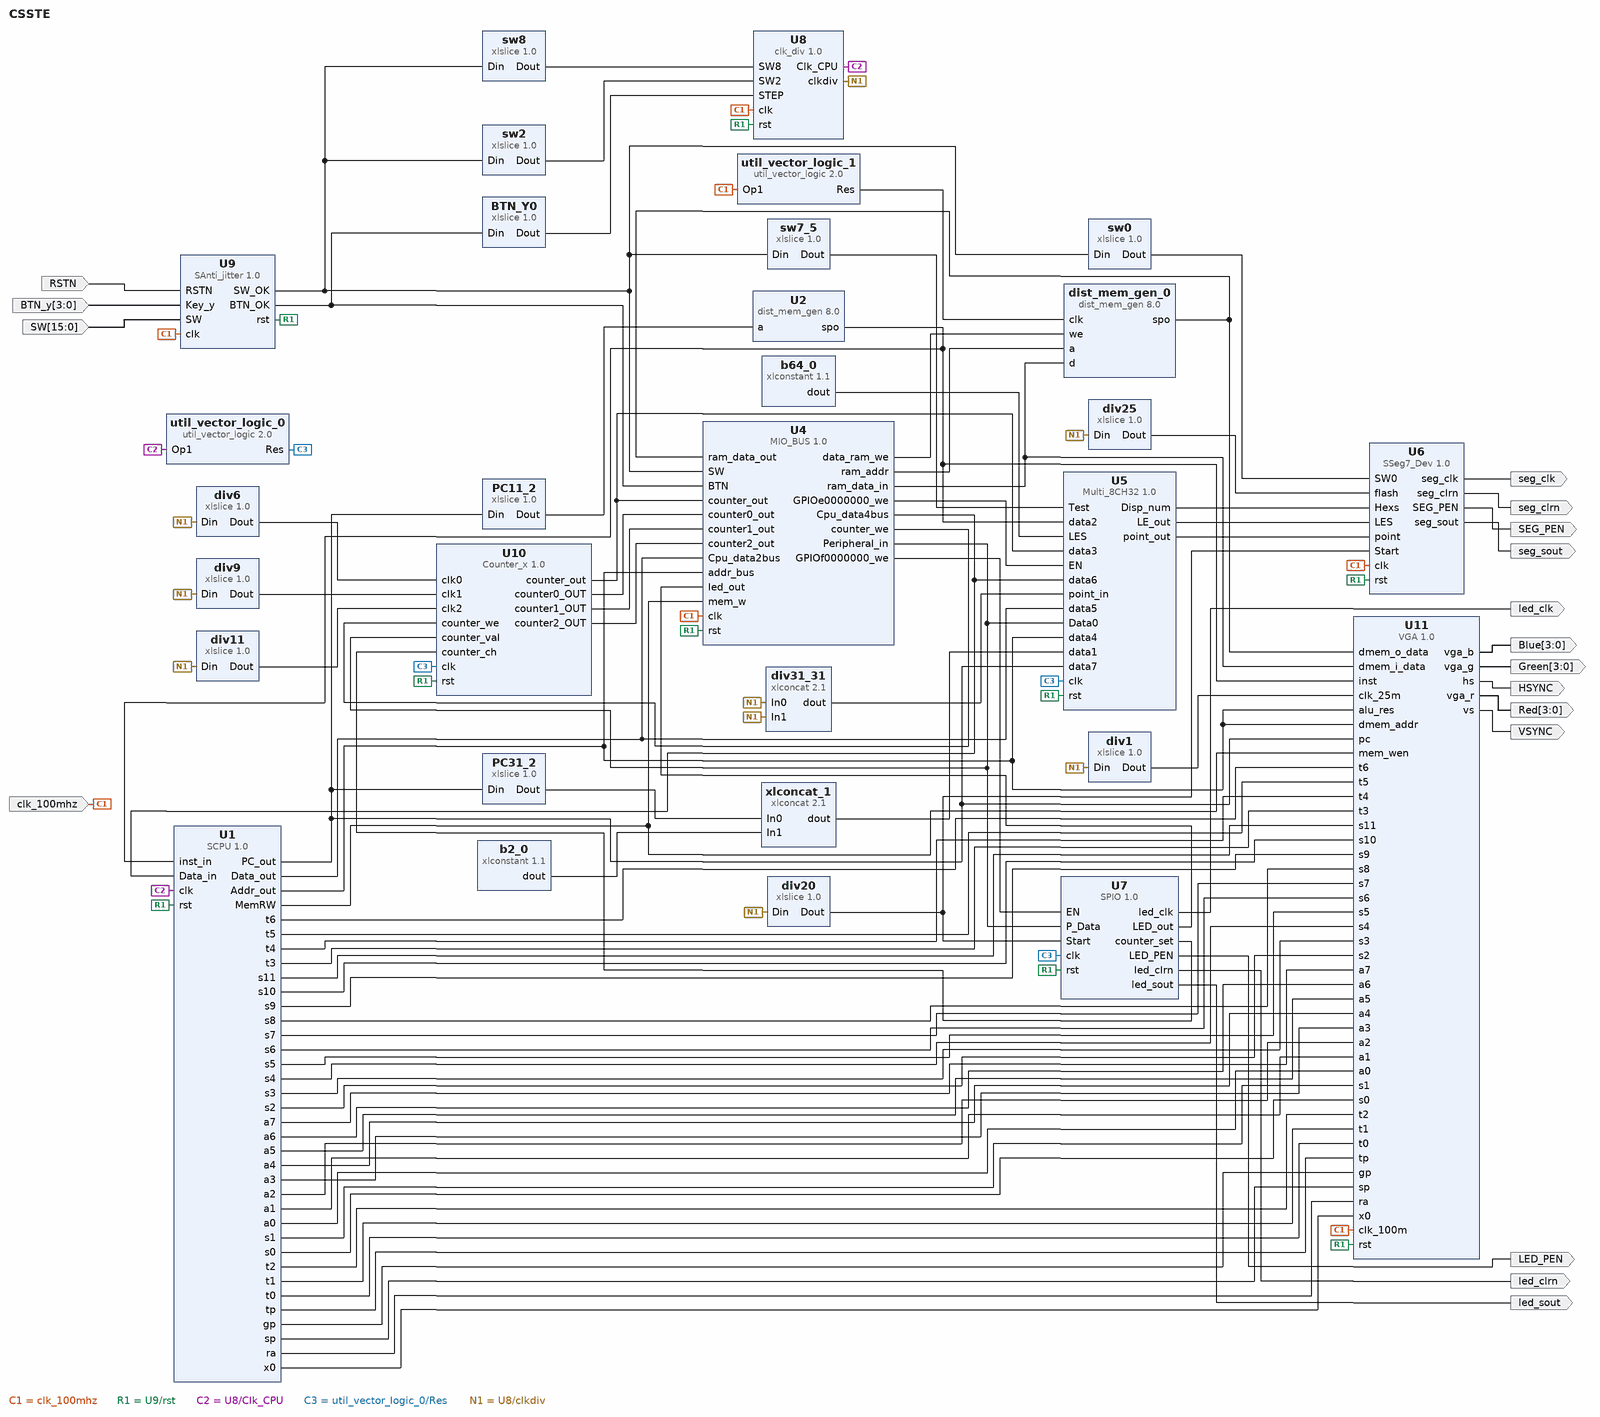
[diagram p0: block diagram of the top level]
# Vivado block design CSSTE, xc7k160tffg676-2L, Vivado 2020.2
create_bd_design CSSTE

create_bd_port -dir I -type rst RSTN
set_property -dict {CONFIG.POLARITY ACTIVE_HIGH} [get_bd_ports RSTN]
create_bd_port -dir I -type clk clk_100mhz
set_property -dict {CONFIG.FREQ_HZ 100000000} [get_bd_ports clk_100mhz]
create_bd_port -dir I -from 3 -to 0 BTN_y
create_bd_port -dir I -from 15 -to 0 SW
create_bd_port -dir O SEG_PEN
create_bd_port -dir O -type clk seg_clk
create_bd_port -dir O seg_clrn
create_bd_port -dir O seg_sout
create_bd_port -dir O LED_PEN
create_bd_port -dir O -type clk led_clk
create_bd_port -dir O led_clrn
create_bd_port -dir O led_sout
create_bd_port -dir O HSYNC
create_bd_port -dir O VSYNC
create_bd_port -dir O -from 3 -to 0 Red
create_bd_port -dir O -from 3 -to 0 Green
create_bd_port -dir O -from 3 -to 0 Blue

create_bd_cell -type ip -vlnv xilinx.com:user:clk_div:1.0 U8
create_bd_cell -type ip -vlnv xilinx.com:user:SSeg7_Dev:1.0 U6
create_bd_cell -type ip -vlnv xilinx.com:user:Counter_x:1.0 U10
create_bd_cell -type ip -vlnv xilinx.com:user:MIO_BUS:1.0 U4
create_bd_cell -type ip -vlnv xilinx.com:user:Multi_8CH32:1.0 U5
create_bd_cell -type ip -vlnv xilinx.com:user:SAnti_jitter:1.0 U9
create_bd_cell -type ip -vlnv xilinx.com:user:SPIO:1.0 U7
create_bd_cell -type ip -vlnv xilinx.com:user:SCPU:1.0 U1
create_bd_cell -type ip -vlnv xilinx.com:user:VGA:1.0 U11
create_bd_cell -type ip -vlnv xilinx.com:ip:dist_mem_gen:8.0 U2
set_property -dict [list \
  CONFIG.coefficient_file ../../../../../../COE/I_mem_more.coe \
  CONFIG.data_width 16 \
  CONFIG.depth 64 \
  CONFIG.memory_type rom \
] [get_bd_cells U2]
create_bd_cell -type ip -vlnv xilinx.com:ip:dist_mem_gen:8.0 dist_mem_gen_0
set_property -dict [list \
  CONFIG.coefficient_file ../../../../../../COE/D_mem.coe \
  CONFIG.data_width 32 \
  CONFIG.depth 1024 \
] [get_bd_cells dist_mem_gen_0]
create_bd_cell -type ip -vlnv xilinx.com:ip:xlslice:1.0 div1
set_property -dict {CONFIG.DIN_FROM 1 CONFIG.DIN_TO 1 CONFIG.DOUT_WIDTH 1} [get_bd_cells div1]
create_bd_cell -type ip -vlnv xilinx.com:ip:xlslice:1.0 div25
set_property -dict {CONFIG.DIN_FROM 25 CONFIG.DIN_TO 25 CONFIG.DOUT_WIDTH 1} [get_bd_cells div25]
create_bd_cell -type ip -vlnv xilinx.com:ip:xlslice:1.0 sw0
set_property -dict {CONFIG.DIN_FROM 0 CONFIG.DIN_TO 0 CONFIG.DIN_WIDTH 16 CONFIG.DOUT_WIDTH 1} [get_bd_cells sw0]
create_bd_cell -type ip -vlnv xilinx.com:ip:xlslice:1.0 BTN_Y0
set_property -dict {CONFIG.DIN_FROM 0 CONFIG.DIN_TO 0 CONFIG.DIN_WIDTH 4 CONFIG.DOUT_WIDTH 1} [get_bd_cells BTN_Y0]
create_bd_cell -type ip -vlnv xilinx.com:ip:util_vector_logic:2.0 util_vector_logic_0
set_property -dict {CONFIG.C_OPERATION not CONFIG.C_SIZE 1} [get_bd_cells util_vector_logic_0]
create_bd_cell -type ip -vlnv xilinx.com:ip:util_vector_logic:2.0 util_vector_logic_1
set_property -dict {CONFIG.C_OPERATION not CONFIG.C_SIZE 1} [get_bd_cells util_vector_logic_1]
create_bd_cell -type ip -vlnv xilinx.com:ip:xlconcat:2.1 div31_31
set_property -dict {CONFIG.IN0_WIDTH 32 CONFIG.IN1_WIDTH 32 CONFIG.dout_width 64} [get_bd_cells div31_31]
create_bd_cell -type ip -vlnv xilinx.com:ip:xlconcat:2.1 xlconcat_1
set_property -dict {CONFIG.dout_width 32} [get_bd_cells xlconcat_1]
create_bd_cell -type ip -vlnv xilinx.com:ip:xlconstant:1.1 b64_0
set_property -dict {CONFIG.CONST_VAL 0 CONFIG.CONST_WIDTH 64} [get_bd_cells b64_0]
create_bd_cell -type ip -vlnv xilinx.com:ip:xlconstant:1.1 b2_0
set_property -dict {CONFIG.CONST_VAL 0 CONFIG.CONST_WIDTH 2} [get_bd_cells b2_0]
create_bd_cell -type ip -vlnv xilinx.com:ip:xlslice:1.0 sw2
set_property -dict {CONFIG.DIN_FROM 2 CONFIG.DIN_TO 2 CONFIG.DIN_WIDTH 16 CONFIG.DOUT_WIDTH 1} [get_bd_cells sw2]
create_bd_cell -type ip -vlnv xilinx.com:ip:xlslice:1.0 sw8
set_property -dict {CONFIG.DIN_FROM 8 CONFIG.DIN_TO 8 CONFIG.DIN_WIDTH 16 CONFIG.DOUT_WIDTH 1} [get_bd_cells sw8]
create_bd_cell -type ip -vlnv xilinx.com:ip:xlslice:1.0 PC11_2
set_property -dict {CONFIG.DIN_FROM 11 CONFIG.DIN_TO 2 CONFIG.DOUT_WIDTH 10} [get_bd_cells PC11_2]
create_bd_cell -type ip -vlnv xilinx.com:ip:xlslice:1.0 div6
set_property -dict {CONFIG.DIN_FROM 6 CONFIG.DIN_TO 6 CONFIG.DOUT_WIDTH 1} [get_bd_cells div6]
create_bd_cell -type ip -vlnv xilinx.com:ip:xlslice:1.0 div9
set_property -dict {CONFIG.DIN_FROM 9 CONFIG.DIN_TO 9 CONFIG.DOUT_WIDTH 1} [get_bd_cells div9]
create_bd_cell -type ip -vlnv xilinx.com:ip:xlslice:1.0 div11
set_property -dict {CONFIG.DIN_FROM 11 CONFIG.DIN_TO 11 CONFIG.DOUT_WIDTH 1} [get_bd_cells div11]
create_bd_cell -type ip -vlnv xilinx.com:ip:xlslice:1.0 sw7_5
set_property -dict {CONFIG.DIN_FROM 7 CONFIG.DIN_TO 5 CONFIG.DIN_WIDTH 16 CONFIG.DOUT_WIDTH 3} [get_bd_cells sw7_5]
create_bd_cell -type ip -vlnv xilinx.com:ip:xlslice:1.0 PC31_2
set_property -dict {CONFIG.DIN_FROM 31 CONFIG.DIN_TO 2 CONFIG.DOUT_WIDTH 30} [get_bd_cells PC31_2]
create_bd_cell -type ip -vlnv xilinx.com:ip:xlslice:1.0 div20
set_property -dict {CONFIG.DIN_FROM 20 CONFIG.DIN_TO 20 CONFIG.DOUT_WIDTH 1} [get_bd_cells div20]

# ---- connections ----

connect_bd_net [get_bd_ports RSTN] [get_bd_pins U9/RSTN]
connect_bd_net [get_bd_ports clk_100mhz] \
  [get_bd_pins U8/clk] [get_bd_pins U6/clk] [get_bd_pins U4/clk] [get_bd_pins U9/clk] [get_bd_pins U11/clk_100m] \
  [get_bd_pins util_vector_logic_1/Op1]
connect_bd_net [get_bd_ports BTN_y] [get_bd_pins U9/Key_y]
connect_bd_net [get_bd_ports SW] [get_bd_pins U9/SW]
connect_bd_net [get_bd_pins U9/BTN_OK] [get_bd_pins U4/BTN] [get_bd_pins BTN_Y0/Din]
connect_bd_net [get_bd_pins U9/SW_OK] [get_bd_pins U4/SW] [get_bd_pins sw0/Din] [get_bd_pins sw2/Din] [get_bd_pins sw8/Din] [get_bd_pins sw7_5/Din]
connect_bd_net [get_bd_pins sw2/Dout] [get_bd_pins U8/SW2]
connect_bd_net [get_bd_pins sw8/Dout] [get_bd_pins U8/SW8]
connect_bd_net [get_bd_pins U9/rst] \
  [get_bd_pins U8/rst] [get_bd_pins U6/rst] [get_bd_pins U10/rst] [get_bd_pins U4/rst] [get_bd_pins U5/rst] \
  [get_bd_pins U7/rst] [get_bd_pins U1/rst] [get_bd_pins U11/rst]
connect_bd_net [get_bd_pins util_vector_logic_1/Res] [get_bd_pins dist_mem_gen_0/clk]
connect_bd_net [get_bd_pins U8/Clk_CPU] [get_bd_pins U1/clk] [get_bd_pins util_vector_logic_0/Op1]
connect_bd_net [get_bd_pins util_vector_logic_0/Res] [get_bd_pins U10/clk] [get_bd_pins U5/clk] [get_bd_pins U7/clk]
connect_bd_net -net SCPU_0_PC_out [get_bd_pins U1/PC_out] \
  [get_bd_pins U5/data7] [get_bd_pins U11/pc] [get_bd_pins PC11_2/Din] [get_bd_pins PC31_2/Din]
connect_bd_net [get_bd_pins PC11_2/Dout] [get_bd_pins U2/a]
connect_bd_net [get_bd_pins U2/spo] [get_bd_pins U5/data2] [get_bd_pins U1/inst_in] [get_bd_pins U11/inst]
connect_bd_net [get_bd_pins U8/clkdiv] \
  [get_bd_pins div1/Din] [get_bd_pins div25/Din] [get_bd_pins div31_31/In0] [get_bd_pins div31_31/In1] [get_bd_pins div6/Din] \
  [get_bd_pins div9/Din] [get_bd_pins div11/Din] [get_bd_pins div20/Din]
connect_bd_net [get_bd_pins div6/Dout] [get_bd_pins U10/clk0]
connect_bd_net [get_bd_pins div9/Dout] [get_bd_pins U10/clk1]
connect_bd_net [get_bd_pins div11/Dout] [get_bd_pins U10/clk2]
connect_bd_net [get_bd_pins U10/counter0_OUT] [get_bd_pins U4/counter0_out]
connect_bd_net [get_bd_pins U10/counter1_OUT] [get_bd_pins U4/counter1_out]
connect_bd_net [get_bd_pins U10/counter2_OUT] [get_bd_pins U4/counter2_out]
connect_bd_net [get_bd_pins U10/counter_out] [get_bd_pins U4/counter_out] [get_bd_pins U5/data3]
connect_bd_net -net SCPU_0_MemRW [get_bd_pins U1/MemRW] [get_bd_pins U4/mem_w] [get_bd_pins U11/mem_wen]
connect_bd_net -net SCPU_0_Data_out [get_bd_pins U1/Data_out] [get_bd_pins U4/Cpu_data2bus] [get_bd_pins U5/data5]
connect_bd_net -net SCPU_0_Addr_out [get_bd_pins U1/Addr_out] \
  [get_bd_pins U4/addr_bus] [get_bd_pins U5/data4] [get_bd_pins U11/alu_res] [get_bd_pins U11/dmem_addr]
connect_bd_net -net U4_Cpu_data4bus [get_bd_pins U4/ram_data_in] [get_bd_pins U11/dmem_i_data] [get_bd_pins dist_mem_gen_0/d]
connect_bd_net [get_bd_pins U4/GPIOe0000000_we] [get_bd_pins U5/EN]
connect_bd_net [get_bd_pins U4/counter_we] [get_bd_pins U10/counter_we]
connect_bd_net [get_bd_pins U4/data_ram_we] [get_bd_pins dist_mem_gen_0/we]
connect_bd_net [get_bd_pins U4/Peripheral_in] [get_bd_pins U10/counter_val] [get_bd_pins U5/Data0] [get_bd_pins U7/P_Data]
connect_bd_net [get_bd_pins U4/ram_addr] [get_bd_pins dist_mem_gen_0/a]
connect_bd_net -net RAM_B_0_douta [get_bd_pins dist_mem_gen_0/spo] [get_bd_pins U4/ram_data_out] [get_bd_pins U11/dmem_o_data]
connect_bd_net -net xlconstant_0_dout [get_bd_pins b64_0/dout] [get_bd_pins U5/LES]
connect_bd_net [get_bd_pins sw7_5/Dout] [get_bd_pins U5/Test]
connect_bd_net [get_bd_pins PC31_2/Dout] [get_bd_pins xlconcat_1/In0]
connect_bd_net [get_bd_pins xlconcat_1/dout] [get_bd_pins U5/data1]
connect_bd_net [get_bd_pins div31_31/dout] [get_bd_pins U5/point_in]
connect_bd_net [get_bd_pins U4/GPIOf0000000_we] [get_bd_pins U7/EN]
connect_bd_net [get_bd_pins div20/Dout] [get_bd_pins U6/Start] [get_bd_pins U7/Start]
connect_bd_net [get_bd_pins U7/LED_out] [get_bd_pins U4/led_out]
connect_bd_net [get_bd_pins U7/counter_set] [get_bd_pins U10/counter_ch]
connect_bd_net [get_bd_pins div1/Dout] [get_bd_pins U11/clk_25m]
connect_bd_net [get_bd_pins sw0/Dout] [get_bd_pins U6/SW0]
connect_bd_net [get_bd_pins div25/Dout] [get_bd_pins U6/flash]
connect_bd_net -net Multi_8CH32_0_Disp_num [get_bd_pins U5/Disp_num] [get_bd_pins U6/Hexs]
connect_bd_net -net Multi_8CH32_0_LE_out [get_bd_pins U5/LE_out] [get_bd_pins U6/LES]
connect_bd_net -net Multi_8CH32_0_point_out [get_bd_pins U5/point_out] [get_bd_pins U6/point]
connect_bd_net [get_bd_pins U6/SEG_PEN] [get_bd_ports SEG_PEN]
connect_bd_net [get_bd_pins U6/seg_clk] [get_bd_ports seg_clk]
connect_bd_net [get_bd_pins U6/seg_clrn] [get_bd_ports seg_clrn]
connect_bd_net [get_bd_pins U6/seg_sout] [get_bd_ports seg_sout]
connect_bd_net [get_bd_pins U7/LED_PEN] [get_bd_ports LED_PEN]
connect_bd_net [get_bd_pins U7/led_clk] [get_bd_ports led_clk]
connect_bd_net [get_bd_pins U7/led_clrn] [get_bd_ports led_clrn]
connect_bd_net [get_bd_pins U7/led_sout] [get_bd_ports led_sout]
connect_bd_net -net VGA_0_hs [get_bd_pins U11/hs] [get_bd_ports HSYNC]
connect_bd_net -net VGA_0_vs [get_bd_pins U11/vs] [get_bd_ports VSYNC]
connect_bd_net -net VGA_0_vga_r [get_bd_pins U11/vga_r] [get_bd_ports Red]
connect_bd_net -net VGA_0_vga_g [get_bd_pins U11/vga_g] [get_bd_ports Green]
connect_bd_net -net VGA_0_vga_b [get_bd_pins U11/vga_b] [get_bd_ports Blue]
connect_bd_net [get_bd_pins U4/Cpu_data4bus] [get_bd_pins U5/data6] [get_bd_pins U1/Data_in]
connect_bd_net [get_bd_pins b2_0/dout] [get_bd_pins xlconcat_1/In1]
connect_bd_net [get_bd_pins U1/t6] [get_bd_pins U11/t6]
connect_bd_net [get_bd_pins U1/t5] [get_bd_pins U11/t5]
connect_bd_net [get_bd_pins U1/t4] [get_bd_pins U11/t4]
connect_bd_net [get_bd_pins U1/t3] [get_bd_pins U11/t3]
connect_bd_net [get_bd_pins U1/s11] [get_bd_pins U11/s11]
connect_bd_net [get_bd_pins U1/s10] [get_bd_pins U11/s10]
connect_bd_net [get_bd_pins U1/s9] [get_bd_pins U11/s9]
connect_bd_net [get_bd_pins U1/s8] [get_bd_pins U11/s8]
connect_bd_net [get_bd_pins U1/s7] [get_bd_pins U11/s7]
connect_bd_net [get_bd_pins U1/s6] [get_bd_pins U11/s6]
connect_bd_net [get_bd_pins U1/s5] [get_bd_pins U11/s5]
connect_bd_net [get_bd_pins U1/s4] [get_bd_pins U11/s4]
connect_bd_net [get_bd_pins U1/s3] [get_bd_pins U11/s3]
connect_bd_net [get_bd_pins U1/s2] [get_bd_pins U11/s2]
connect_bd_net [get_bd_pins U1/a7] [get_bd_pins U11/a7]
connect_bd_net [get_bd_pins U1/a6] [get_bd_pins U11/a6]
connect_bd_net [get_bd_pins U1/a5] [get_bd_pins U11/a5]
connect_bd_net [get_bd_pins U1/a4] [get_bd_pins U11/a4]
connect_bd_net [get_bd_pins U1/a3] [get_bd_pins U11/a3]
connect_bd_net [get_bd_pins U1/a2] [get_bd_pins U11/a2]
connect_bd_net [get_bd_pins U1/a1] [get_bd_pins U11/a1]
connect_bd_net [get_bd_pins U1/a0] [get_bd_pins U11/a0]
connect_bd_net [get_bd_pins U1/s1] [get_bd_pins U11/s1]
connect_bd_net [get_bd_pins U1/s0] [get_bd_pins U11/s0]
connect_bd_net [get_bd_pins U1/t2] [get_bd_pins U11/t2]
connect_bd_net [get_bd_pins U1/t1] [get_bd_pins U11/t1]
connect_bd_net [get_bd_pins U1/t0] [get_bd_pins U11/t0]
connect_bd_net [get_bd_pins U1/tp] [get_bd_pins U11/tp]
connect_bd_net [get_bd_pins U1/gp] [get_bd_pins U11/gp]
connect_bd_net [get_bd_pins U1/sp] [get_bd_pins U11/sp]
connect_bd_net [get_bd_pins U1/ra] [get_bd_pins U11/ra]
connect_bd_net [get_bd_pins U1/x0] [get_bd_pins U11/x0]
connect_bd_net [get_bd_pins BTN_Y0/Dout] [get_bd_pins U8/STEP]

set_property USER_COMMENTS.comment_0 {BTN_OK[0]} [current_bd_design]
set_property USER_COMMENTS.comment_20 {Addr_out[31:0]} [current_bd_design]
set_property USER_COMMENTS.comment_15 . [current_bd_design]
set_property USER_COMMENTS.comment_21 {Data_out[31:0]} [current_bd_design]
set_property USER_COMMENTS.comment_1 {~clk_100mhz} [current_bd_design]
set_property USER_COMMENTS.comment_22 {Data_in[31:0]} [current_bd_design]
set_property USER_COMMENTS.comment_3 {PC[11:2]} [current_bd_design]
set_property USER_COMMENTS.comment_16 . [current_bd_design]
set_property USER_COMMENTS.comment_17 {{2'b0,PC[31:2]}} [current_bd_design]
set_property USER_COMMENTS.comment_18 {inst[31:0]} [current_bd_design]
set_property USER_COMMENTS.comment_19 {Counter_out[31:0]} [current_bd_design]
set_property USER_COMMENTS.comment_9 {sw[7:5]]} [current_bd_design]
set_property USER_COMMENTS.comment_10 . [current_bd_design]
set_property USER_COMMENTS.comment_23 . [current_bd_design]
set_property USER_COMMENTS.comment_24 . [current_bd_design]

validate_bd_design
save_bd_design
